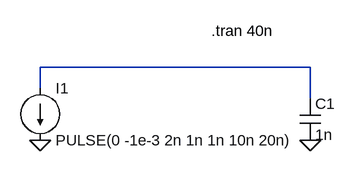
[diagram p0: schematic question10and11.asc]
question10and11.asc, the LTspice schematic file:
Version 4
SHEET 1 880 680
WIRE 448 80 32 80
WIRE 32 112 32 80
WIRE 448 128 448 80
FLAG 32 192 0
FLAG 448 192 0
SYMBOL cap 432 128 R0
SYMATTR InstName C1
SYMATTR Value 1n
SYMBOL current 32 112 R0
WINDOW 123 0 0 Left 0
WINDOW 39 0 0 Left 0
SYMATTR InstName I1
SYMATTR Value PULSE(0 -1e-3 2n 1n 1n 10n 20n)
TEXT 296 24 Left 2 !.tran 40n

The netlist it stands for:
* question10and11.asc
C1 N001 0 1n
I1 N001 0 PULSE(0 -1e-3 2n 1n 1n 10n 20n)
.tran 40n
.backanno
.end